# EAGLE design sensor-breakout (EAGLE 6.5.0)
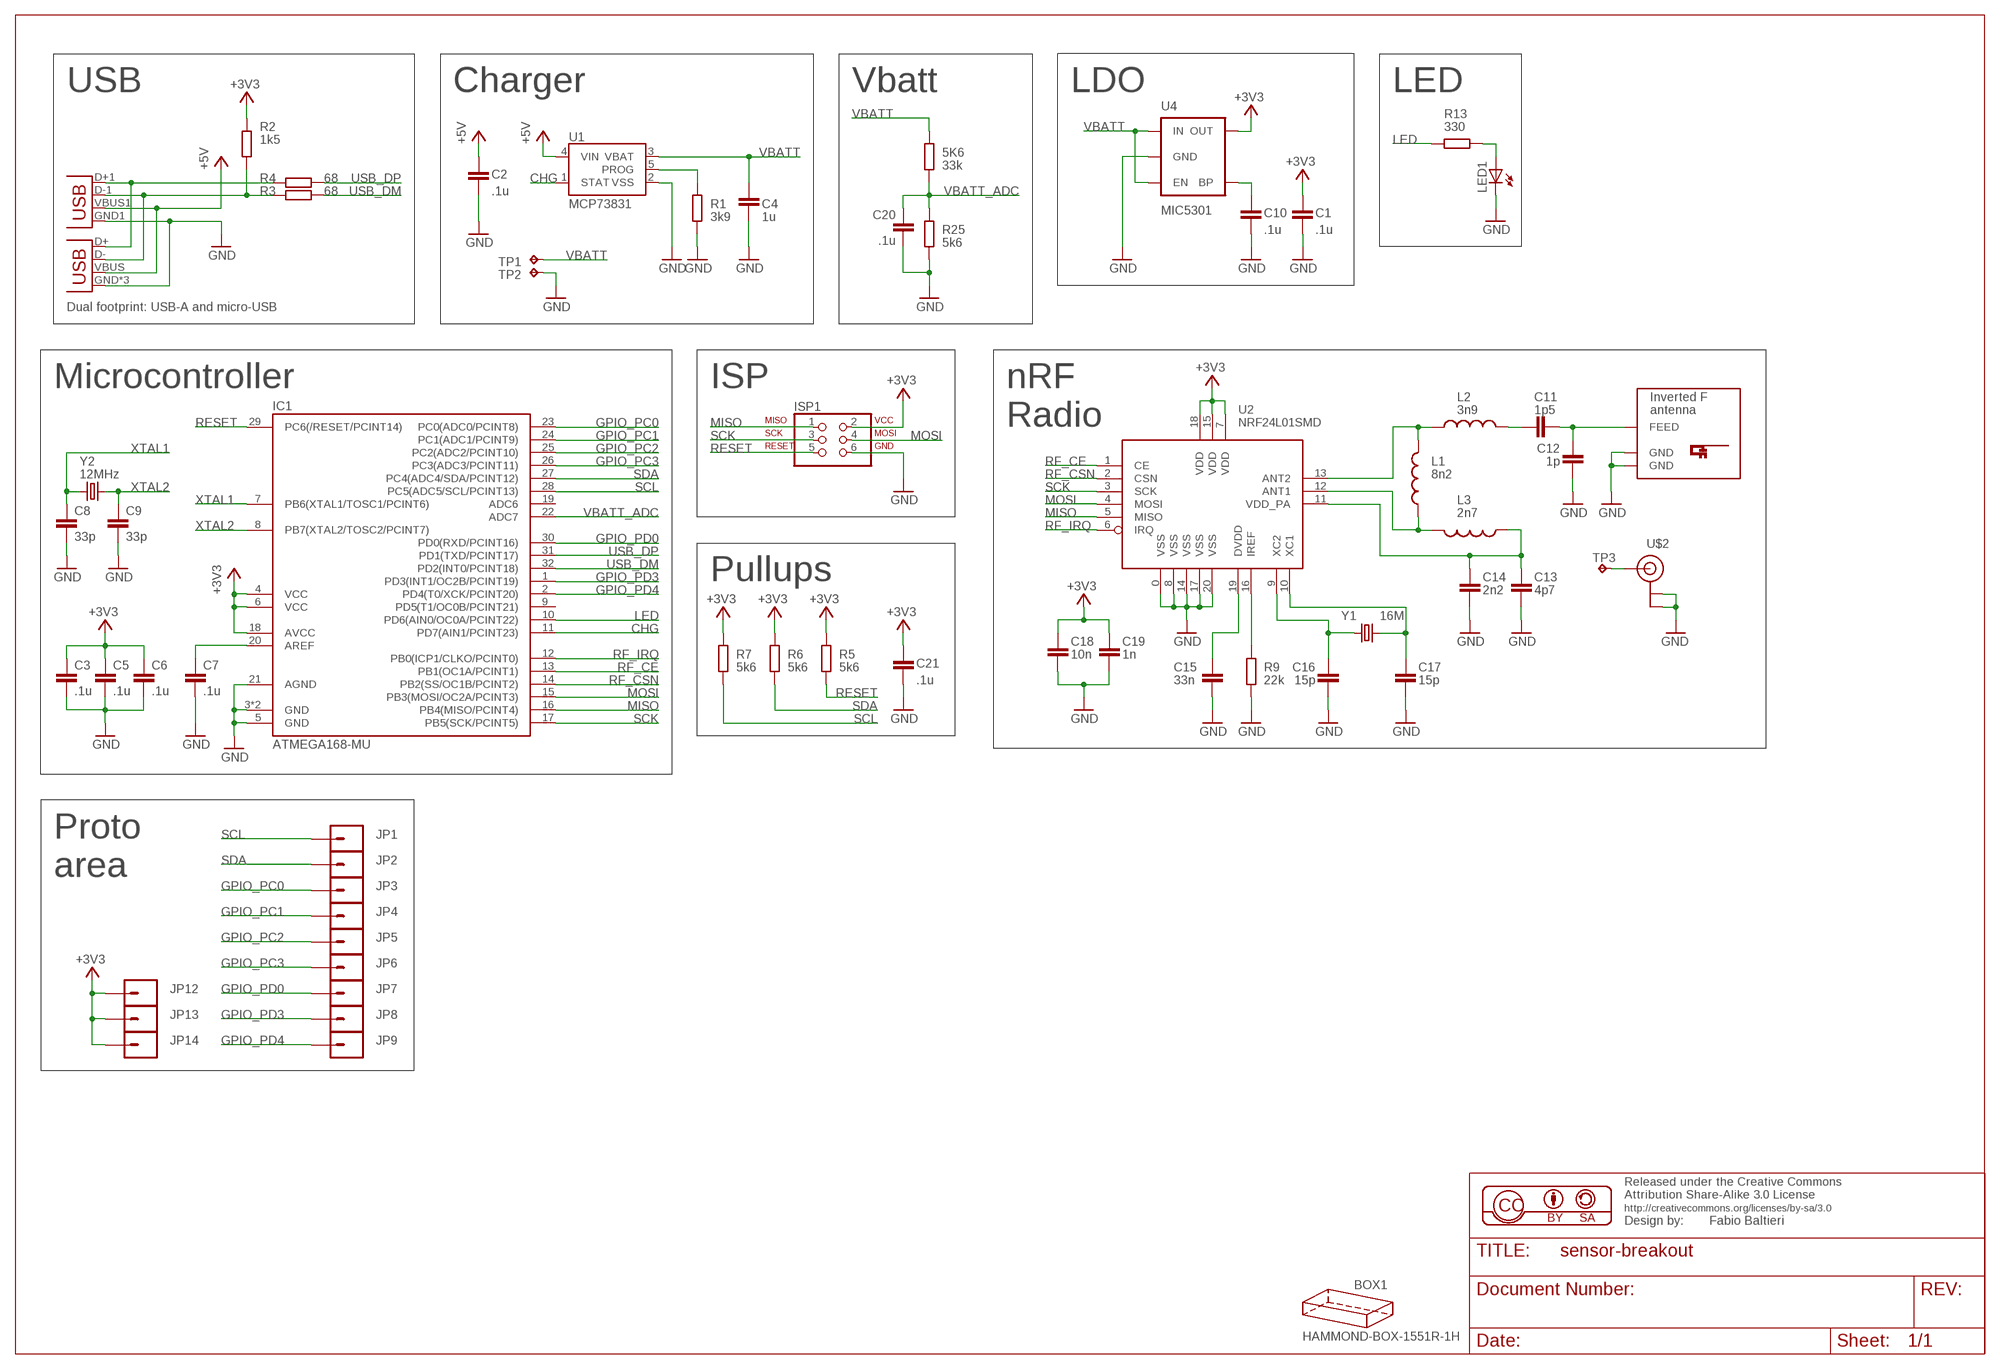
[diagram p0: schematic, sheet 1]

## Parts
5K6  33k  R-EU_R0603  [R0603]
BOX1  HAMMOND-BOX-1551R-1H  [1551R-1HOLE]
C1  .1u  C-EUC0603  [C0603]
C2  .1u  C-EUC0603  [C0603]
C3  .1u  C-EUC0603  [C0603]
C4  1u  C-EUC0603  [C0603]
C5  .1u  C-EUC0603  [C0603]
C6  .1u  C-EUC0603  [C0603]
C7  .1u  C-EUC0603  [C0603]
C8  33p  C-EUC0603  [C0603]
C9  33p  C-EUC0603  [C0603]
C10  .1u  C-EUC0603  [C0603]
C11  1p5  C-EUC0603  [C0603]
C12  1p  C-EUC0603  [C0603]
C13  4p7  C-EUC0603  [C0603]
C14  2n2  C-EUC0603  [C0603]
C15  33n  C-EUC0603  [C0603]
C16  15p  C-EUC0603  [C0603]
C17  15p  C-EUC0603  [C0603]
C18  10n  C-EUC0603  [C0603]
C19  1n  C-EUC0603  [C0603]
C20  .1u  C-EUC0603  [C0603]
C21  .1u  C-EUC0603  [C0603]
IC1  ATMEGA168-MU  [MLF32-TH]
ISP1  ISP-AVR910PTH  [2X03]
JP1  M01NOSILK-KIT  [1X01NS-KIT]
JP2  M01NOSILK-KIT  [1X01NS-KIT]
JP3  M01NOSILK-KIT  [1X01NS-KIT]
JP4  M01NOSILK-KIT  [1X01NS-KIT]
JP5  M01NOSILK-KIT  [1X01NS-KIT]
JP6  M01NOSILK-KIT  [1X01NS-KIT]
JP7  M01NOSILK-KIT  [1X01NS-KIT]
JP8  M01NOSILK-KIT  [1X01NS-KIT]
JP9  M01NOSILK-KIT  [1X01NS-KIT]
JP10  USB-MICROB  [USB-MICROB]
JP11  USBA-SMD-MALE  [USB-A-SMT-MALE]
JP12  M01NOSILK-KIT  [1X01NS-KIT]
JP13  M01NOSILK-KIT  [1X01NS-KIT]
JP14  M01NOSILK-KIT  [1X01NS-KIT]
L1  8n2  INDUCTOR0603  [0603]
L2  3n9  INDUCTOR0603  [0603]
L3  2n7  INDUCTOR0603  [0603]
LED1  LEDSML0805  [SML0805]
R1  3k9  R-EU_R0603  [R0603]
R2  1k5  R-EU_R0603  [R0603]
R3  68  R-EU_R0603  [R0603]
R4  68  R-EU_R0603  [R0603]
R5  5k6  R-EU_R0603  [R0603]
R6  5k6  R-EU_R0603  [R0603]
R7  5k6  R-EU_R0603  [R0603]
R9  22k  R-EU_R0603  [R0603]
R13  330  R-EU_R0603  [R0603]
R25  5k6  R-EU_R0603  [R0603]
TP1  TPTP12R  [TP12R]
TP2  TPTP12R  [TP12R]
TP3  TPTP08SQ  [TP08SQ]
U1  MCP73831  [SOT23-5]
U2  NRF24L01SMD  [QFN20]
U4  MIC5301  V_REG_LDOSMD  [SOT23-5]
U$1  INVERTED_F_ANTENNA-2  [DN007-2]
U$2  U.FL  [U.FL]
Y1  16M  CRYSTAL5X3  [CRYSTAL-SMD-5X3]
Y2  12MHz  CRYSTAL5X3  [CRYSTAL-SMD-5X3]

## Nets
+3V3: C1.1 C3.1 C5.1 C6.1 C18.1 C19.1 C21.1 IC1.4(VCC) IC1.6(VCC) IC1.18(AVCC) ISP1.2 JP12.1 JP13.1 JP14.1 R2.2 R5.1 R6.1 R7.1 U2.7(VDD) U2.15(VDD) U2.18(VDD) U4.5(OUT)
+5V: C2.1 JP10.VBUS JP11.VBUS1(VBUS) U1.4(VIN)
CHG: IC1.11(PD7(AIN1/PCINT23)) U1.1(STAT)
GND: C1.2 C2.2 C3.2 C4.2 C5.2 C6.2 C7.2 C8.2 C9.2 C10.2 C12.2 C13.2 C14.2 C15.2 C16.2 C17.2 C18.2 C19.2 C20.2 C21.2 IC1.3(GND) IC1.5(GND) IC1.21(AGND) IC1.TH(GND) ISP1.6 JP10.GND JP10.MT1(GND) JP10.MT2(GND) JP11.GND1(GND) LED1.C R1.2 R9.2 R25.2 TP2.TP U1.2(VSS) U2.0(VSS) U2.8(VSS) U2.14(VSS) U2.17(VSS) U2.20(VSS) U4.2(GND) U$1.GND U$1.GND@1(GND) U$2.P$1(GND) U$2.P$2(GND)
GPIO_PC0: IC1.23(PC0(ADC0/PCINT8)) JP3.1
GPIO_PC1: IC1.24(PC1(ADC1/PCINT9)) JP4.1
GPIO_PC2: IC1.25(PC2(ADC2/PCINT10)) JP5.1
GPIO_PC3: IC1.26(PC3(ADC3/PCINT11)) JP6.1
GPIO_PD0: IC1.30(PD0(RXD/PCINT16)) JP7.1
GPIO_PD3: IC1.1(PD3(INT1/OC2B/PCINT19)) JP8.1
GPIO_PD4: IC1.2(PD4(T0/XCK/PCINT20)) JP9.1
LED: IC1.10(PD6(AIN0/OC0A/PCINT22)) R13.2
MISO: IC1.16(PB4(MISO/PCINT4)) ISP1.1 U2.5(MISO)
MOSI: IC1.15(PB3(MOSI/OC2A/PCINT3)) ISP1.4 U2.4(MOSI)
N$1: JP10.D+ JP11.D+1(D+) R4.2
N$2: C7.1 IC1.20(AREF)
N$3: LED1.A R13.1
N$4: R1.1 U1.5(PROG)
N$5: L1.2 L3.2 U2.12(ANT1)
N$6: L1.1 L2.1 U2.13(ANT2)
N$7: JP10.D- JP11.D-1(D-) R2.1 R3.2
N$8: C10.1 U4.4(BP)
N$10: C11.1 L2.2
N$13: C11.2 C12.1 U$1.FEED
N$14: C13.1 C14.1 L3.1 U2.11(VDD_PA)
N$15: C15.1 U2.19(DVDD)
N$16: R9.1 U2.16(IREF)
N$17: C17.1 U2.10(XC1) Y1.3
N$18: C16.1 U2.9(XC2) Y1.1
N$19: TP3.TP U$2.P$3(SIGNAL)
RESET: IC1.29(PC6(/RESET/PCINT14)) ISP1.5 R5.2
RF_CE: IC1.13(PB1(OC1A/PCINT1)) U2.1(CE)
RF_CSN: IC1.14(PB2(SS/OC1B/PCINT2)) U2.2(CSN)
RF_IRQ: IC1.12(PB0(ICP1/CLKO/PCINT0)) U2.6(IRQ)
SCK: IC1.17(PB5(SCK/PCINT5)) ISP1.3 U2.3(SCK)
SCL: IC1.28(PC5(ADC5/SCL/PCINT13)) JP1.1 R7.2
SDA: IC1.27(PC4(ADC4/SDA/PCINT12)) JP2.1 R6.2
USB_DM: IC1.32(PD2(INT0/PCINT18)) R3.1
USB_DP: IC1.31(PD1(TXD/PCINT17)) R4.1
VBATT: 5K6.1 C4.1 TP1.TP U1.3(VBAT) U4.1(IN) U4.3(EN)
VBATT_ADC: 5K6.2 C20.1 IC1.22(ADC7) R25.1
XTAL1: C8.1 IC1.7(PB6(XTAL1/TOSC1/PCINT6)) Y2.1
XTAL2: C9.1 IC1.8(PB7(XTAL2/TOSC2/PCINT7)) Y2.3
Unconnected: IC1.9(PD5(T1/OC0B/PCINT21)) IC1.19(ADC6)

## Notes on the sheet
- USB | Charger | Vbatt | LDO | LED
- Dual footprint: USB-A and micro-USB
- Microcontroller | ISP | nRF
- Radio
- Pullups
- Proto
  area

## Library data of the parts
5K6 R1-R7 R9 R13 R25 = rcl:R-EU_: RESISTOR, European symbol
BOX1 = hammond:HAMMOND-BOX: Hammond Project boxes Hammond 1551 Transluscent Blue 50x35x20mm 1551GTBU http://www.hammondmfg.com/pdf/1551G.pdf Hammond 1551 Transluscent Blue 50x50x20mm 1551RTBU http://www.hammondmfg.com/pdf/1551R.pdf Hammond 1551 Transluscent Blue 60x35x20mm 1551HTBU http://www.hammondmfg.com/pdf/1551H.pdf Hammond 1551 Transluscent Blue 80x40x20mm 1551KTBU http://www.hammondmfg.com/pdf/1551K.pdf Hammond 1591 Transluscent Blue 100x51x22m m 1591XXATBU http://www.hammondmfg.com/pdf/1591XXA.pdf
C1-C21 = rcl:C-EU: CAPACITOR, European symbol
IC1 = balto:ATMEGA168
ISP1 = balto:ISP-AVR910: PIN HEADER
JP1-JP9 JP12-JP14 = SparkFun-Connectors:M01: Header 1 Standard 1-pin 0.1" header. Use with straight break away headers (SKU : PRT-00116), right angle break away headers (PRT-00553), swiss pins (PRT-00743), machine pins (PRT-00117), and female headers (PRT-00115).
JP10 = SparkFun-Connectors:USB: USB Connectors USB-B-PTH is fully proven SKU : PRT-00139/CONN-08278 USB-miniB is fully proven SKU : PRT-00587 USB-A-PCB is untested. USB-A-H is throughly reviewed, but untested. Spark Fun Electronics SKU : PRT-00437 USB-B-SMT is throughly reviewed, but untested. Needs silkscreen touching up. USB-A-S has not been used/tested USB-MB-H has not been used/tested USB-MICROB has been used. CONN-09505; PROD_ID: CONN-09505
JP11 = SparkFun-Connectors:USB: USB Connectors USB-B-PTH is fully proven SKU : PRT-00139/CONN-08278 USB-miniB is fully proven SKU : PRT-00587 USB-A-PCB is untested. USB-A-H is throughly reviewed, but untested. Spark Fun Electronics SKU : PRT-00437 USB-B-SMT is throughly reviewed, but untested. Needs silkscreen touching up. USB-A-S has not been used/tested USB-MB-H has not been used/tested USB-MICROB has been used. CONN-09505
L1-L3 = SparkFun:INDUCTOR: Inductors Basic Inductor/Choke - 0603 and 1206. Footprints are not proven and vary greatly between part numbers.
LED1 = led:LED: LED OSRAM: - CHIPLED LG R971, LG N971, LY N971, LG Q971, LY Q971, LO R971, LY R971 LH N974, LH R974 LS Q976, LO Q976, LY Q976 LO Q996 - Hyper CHIPLED LW Q18S LB Q993, LB Q99A, LB R99A - SideLED LS A670, LO A670, LY A670, LG A670, LP A670 LB A673, LV A673, LT A673, LW A673 LH A674 LY A675 LS A676, LA A676, LO A676, LY A676, LW A676 LS A679, LY A679, LG A679 - Hyper Micro SIDELED® LS Y876, LA Y876, LO Y876, LY Y876 LT Y87S - SmartLED LW L88C, LW L88S LB L89C, LB L89S, LG L890 LS L89K, LO L89K, LY L89K LS L896, LA L896, LO L896, LY L896 - TOPLED LS T670, LO T670, LY T670, LG T670, LP T670 LSG T670, LSP T670, LSY T670, LOP T670, LYG T670 LG T671, LOG T671, LSG T671 LB T673, LV T673, LT T673, LW T673 LH T674 LS T676, LA T676, LO T676, LY T676, LB T676, LH T676, LSB T676, LW T676 LB T67C, LV T67C, LT T67C, LS T67K, LO T67K, LY T67K, LW E67C LS E67B, LA E67B, LO E67B, LY E67B, LB E67C, LV E67C, LT E67C LW T67C LS T679, LY T679, LG T679 LS T770, LO T770, LY T770, LG T770, LP T770 LB T773, LV T773, LT T773, LW T773 LH T774 LS E675, LA E675, LY E675, LS T675 LS T776, LA T776, LO T776, LY T776, LB T776 LHGB T686 LT T68C, LB T68C - Hyper Mini TOPLED® LB M676 - Mini TOPLED Santana® LG M470 LS M47K, LO M47K, LY M47K Source: http://www.osram.convergy.de LUXEON: - LUMILED® LXK2-PW12-R00, LXK2-PW12-S00, LXK2-PW14-U00, LXK2-PW14-V00 LXK2-PM12-R00, LXK2-PM12-S00, LXK2-PM14-U00 LXK2-PE12-Q00, LXK2-PE12-R00, LXK2-PE12-S00, LXK2-PE14-T00, LXK2-PE14-U00 LXK2-PB12-K00, LXK2-PB12-L00, LXK2-PB12-M00, LXK2-PB14-N00, LXK2-PB14-P00, LXK2-PB14-Q00 LXK2-PR12-L00, LXK2-PR12-M00, LXK2-PR14-Q00, LXK2-PR14-R00 LXK2-PD12-Q00, LXK2-PD12-R00, LXK2-PD12-S00 LXK2-PH12-R00, LXK2-PH12-S00 LXK2-PL12-P00, LXK2-PL12-Q00, LXK2-PL12-R00 Source: www.luxeon.com KINGBRIGHT: KA-3528ASYC Source: www.kingbright.com
TP1-TP3 = testpad:TP: Test pad
U1 = SparkFun-PowerIC:MCP73831: Miniature single cell, fully integrated Li-Ion, Li-polymer charge management controller http://ww1.microchip.com/downloads/en/DeviceDoc/21984a.pdf IC-09995; PROD_ID: IC-09995
U2 = SparkFun:NRF24L01: 2.4GHz Low Power Transceiver This is the very popular, low cost, very low power RF transceiver from Nordic Semiconductor. Simple SPI interface. SKU: COM-00690
U4 = SparkFun-PowerIC:V_REG_LDO: Voltage Regulator LDO Standard 150mA LDO voltage regulator in SOT-23 layout. Micrel part MIC5205. BP (by-pass) pin is used to lower output noise with 470pF cap.
U$1 = antenna:INVERTED_F_ANTENNA: 2.4GHz Inverted F Antenna Based on TI Design Note DN007
U$2 = SparkFun-Connectors:U.FL: SMD antenna connector- WRL-09144
Y1 = SparkFun:CRYSTAL: Crystals Various standard crystals. Proven footprints. Spark Fun Electronics SKU : COM-00534
Y2 = SparkFun-FreqCtrl:CRYSTAL: Various standard crystals. Proven footprints. Spark Fun Electronics SKU : COM-00534

## Net classes
1 power: width 0.254 mm

## Board
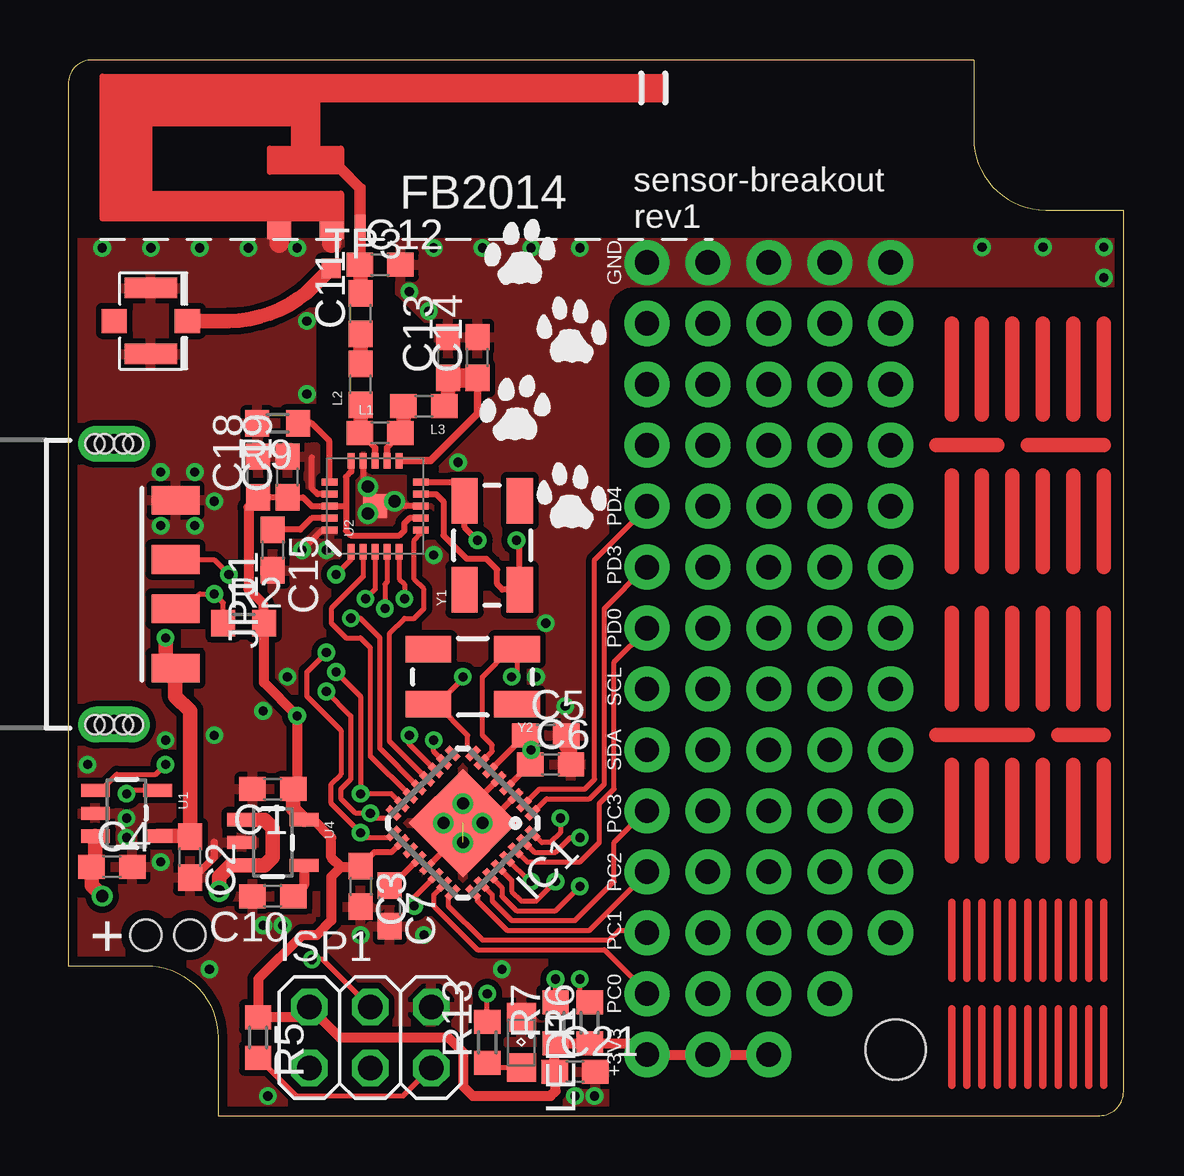
[diagram p1: board, top side]
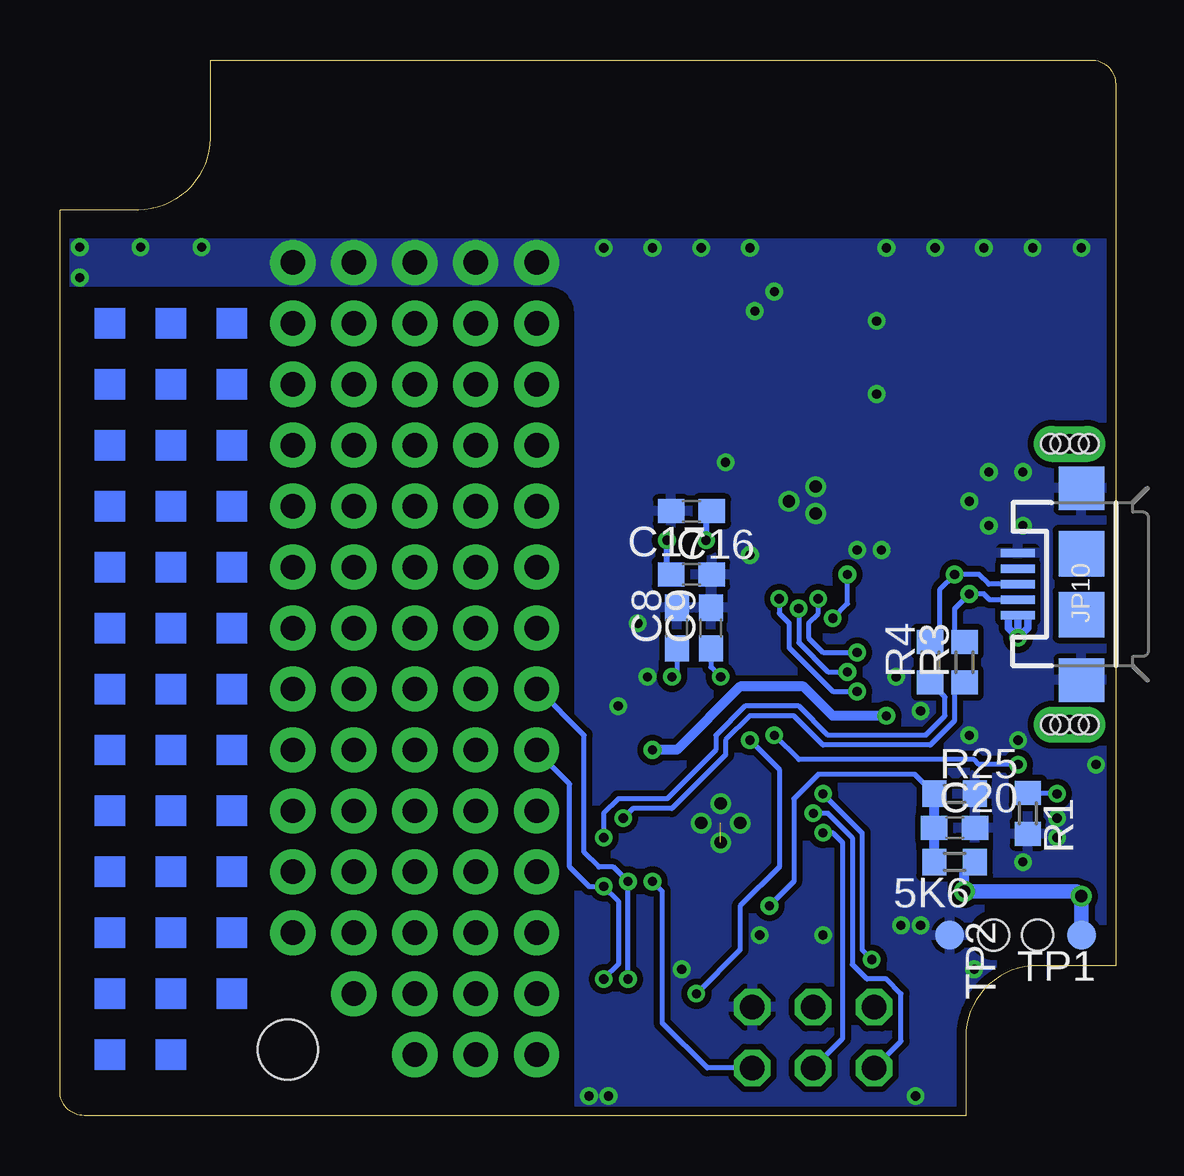
[diagram p2: board, bottom side, seen from below]

Size 44 x 44 mm. Coordinates in mm from the lower left corner, seen from the top.
Copper layers (1*16): Top 0.035mm / dielectric 1.5mm / Bottom 0.035mm
Design rules "balto": minimum track width 6mil, minimum drill 13mil, track to track 6mil, track to pad 6mil, pad to pad 6mil, via to via 6mil, smd to smd 6mil, copper to edge 15mil, drill to drill 6mil, minimum pad ring 7mil, minimum via ring 7mil, stop-mask expansion 2mil, vias tented up to drill 20mil, thermal gap 8mil
Holes 1.3 mm at 5.08,7.52 3.25,7.52

### Footprints (pad centres in the part's own frame; a part is rotated, then mirrored left to right if it is on the bottom)
R0603 = smd 1 x 1.1: 1 -0.85,0; 2 0.85,0
1551R-1HOLE = hole 2.5: 9.5,41.25
C0603 = smd 1.1 x 1: 1 -0.85,0; 2 0.85,0
MLF32-TH = smd 0.65 x 0.29: 1 -2.35,1.75; 2 -2.35,1.25; 3 -2.35,0.75; 4 -2.35,0.25; 5 -2.35,-0.25; 6 -2.35,-0.75; 7 -2.35,-1.25; 8 -2.35,-1.75; 17 2.35,-1.75; 18 2.35,-1.25; 19 2.35,-0.75; 20 2.35,-0.25; 21 2.35,0.25; 22 2.35,0.75; 23 2.35,1.25; 24 2.35,1.75 | smd 0.29 x 0.65: 9 -1.75,-2.35; 10 -1.25,-2.35; 11 -0.75,-2.35; 12 -0.25,-2.35; 13 0.25,-2.35; 14 0.75,-2.35; 15 1.25,-2.35; 16 1.75,-2.35; 25 1.75,2.35; 26 1.25,2.35; 27 0.75,2.35; 28 0.25,2.35; 29 -0.25,2.35; 30 -0.75,2.35; 31 -1.25,2.35; 32 -1.75,2.35 | smd 3.2 x 3.2: TH 0,0
2X03 = drill 1.016 octagon: 1 -2.54,-1.27; 2 -2.54,1.27; 3 0,-1.27; 4 0,1.27; 5 2.54,-1.27; 6 2.54,1.27
1X01NS-KIT = drill 1.016 pad 1.88: 1 0,0
USB-MICROB = smd 0.35 x 1.4: D+ 0,2.65; D- -0.65,2.65; GND 1.3,2.65; ID 0.65,2.65; VBUS -1.3,2.65 | smd 1.8 x 1.9: MT1 -4,0; MT2 4,0 | smd 1.9 x 1.9: P$1 -1.27,0; P$2 1.27,0
USB-A-SMT-MALE = smd 1.2 x 2: D+1 1.027,-3.67; D-1 -1.027,-3.67; GND1 3.5,-3.67; VBUS1 -3.5,-3.67 | drill 0.8 pad 1.5 long: P$1 5.85,-1.1; P$3 -5.85,-1.1 | hole 0.8: -5.85,-1.5; -5.85,-1.9; -5.85,-0.7; -5.85,-0.3; 5.85,-1.5; 5.85,-1.9; 5.85,-0.7; 5.85,-0.3
0603 = smd 1.1 x 1: 1 -0.85,0; 2 0.85,0
SML0805 = smd 1.2 x 1.2: A 1.05,0; C -1.05,0
TP12R = smd 1.2 x 1.2: TP 0,0
TP08SQ = smd 0.8 x 0.8: TP 0,0
SOT23-5 = smd 0.55 x 1.2: 1 -0.95,-1.3; 2 0,-1.3; 3 0.95,-1.3; 4 0.95,1.3; 5 -0.95,1.3
QFN20 = smd 1 x 1: 0 0,0 | smd 0.65 x 0.29: 1 -1.9,1; 2 -1.9,0.5; 3 -1.9,0; 4 -1.9,-0.5; 5 -1.9,-1; 11 1.9,-1; 12 1.9,-0.5; 13 1.9,0; 14 1.9,0.5; 15 1.9,1 | smd 0.29 x 0.65: 6 -1,-1.9; 7 -0.5,-1.9; 8 0,-1.9; 9 0.5,-1.9; 10 1,-1.9; 16 1,1.9; 17 0.5,1.9; 18 0,1.9; 19 -0.5,1.9; 20 -1,1.9
DN007-2 = smd 0.46 x 1: FEED 2.22,-2.8 | smd 1.01 x 0.74: GND -1.16,-2.93; GND@1 1.035,-2.93
U.FL = smd 2.2 x 0.85: P$1 0,1.375; P$2 0,-1.375 | smd 1.05 x 1: P$3 1.525,0; P$4 -1.525,0
CRYSTAL-SMD-5X3 = smd 1.9 x 1.1: 1 -1.85,-1.15; 2 1.85,-1.15; 3 1.85,1.15; 4 -1.85,1.15

### Placement (x,y rotation side)
5K6  6.71,10.57 180 bottom
BOX1  44,44 180 top
C1  8.53,13.61 180 top
C2  5.08,10.77 270 top
C3  12.19,9.55 270 top
C4  1.83,10.36 0 top
C5  19.91,15.85 0 top
C6  20.12,14.63 0 top
C7  13.41,8.74 270 top
C8  18.29,20.32 90 bottom
C9  16.87,20.32 90 bottom
C10  8.53,9.14 180 top
C11  12.19,33.43 90 top
C12  13,35.46 0 top
C13  15.85,31.6 90 top
C14  17.07,31.6 90 top
C15  8.53,23.57 270 top
C16  17.68,22.56 0 bottom
C17  17.68,25.2 180 bottom
C18  7.92,26.62 90 top
C19  9.14,26.62 90 top
C20  6.71,11.99 0 bottom
C21  21.13,1.83 0 top
IC1  16.46,12.19 225 top
ISP1  12.6,3.25 0 top
JP1  24.13,17.78 0 top
JP2  24.13,15.24 0 top
JP3  24.13,5.08 0 top
JP4  24.13,7.62 0 top
JP5  24.13,10.16 0 top
JP6  24.13,12.7 180 top
JP7  24.13,20.32 180 top
JP8  24.13,22.86 180 top
JP9  24.13,25.4 180 top
JP10  1.42,22.15 90 bottom
JP11  0.81,22.15 90 top
JP12  24.13,2.54 0 top
JP13  26.67,2.54 0 top
JP14  29.21,2.54 0 top
L1  13,28.45 0 top
L2  12.19,30.48 90 top
L3  14.83,29.57 180 top
LED1  18.9,3.05 270 top
R1  3.66,12.6 270 bottom
R2  7.32,20.52 0 top
R3  6.3,18.9 90 bottom
R4  7.72,18.9 90 bottom
R5  7.92,3.25 270 top
R6  21.74,3.86 90 top
R7  20.32,3.86 90 top
R9  8.74,28.85 180 top
R13  17.48,3.05 90 top
R25  6.71,13.41 0 bottom
TP1  1.42,7.52 180 bottom
TP2  6.91,7.52 270 bottom
TP3  10.97,35.32 0 top
U1  2.44,12.6 270 top
U2  12.8,25.4 90 top
U4  8.53,11.38 270 top
U$1  9.96,39.83 0 top
U$2  3.45,33.12 0 top
U$3  [CAT-R]  20.93,25.4 0 top
U$4  [CAT-L]  18.69,29.06 0 top
U$5  [CAT-R]  20.93,32.31 0 top
U$6  [CAT-L]  18.9,35.56 0 top
Y1  17.68,23.77 90 top
Y2  16.87,18.29 180 top

### Tracks (layer width: path | path; a pad name or v marks a point on that pad's centre or on a via)
+3V3  (via drill 0.38)
  Top 0.203: C6.1 19.25,14.63
  Top 0.254: U2.15 11.8,26.84 11.58,26.62 11.58,25.4 | 11.58,25.4 11.58,24.38 11.79,24.18 13.82,24.18 14.02,24.38 14.02,24.69 14.23,24.9 U2.7 | 11.58,25.4 U2.18 10.16,25.4 9.79,25.77 C19.1 C18.1 | IC1.6 C5.1 | IC1.4 19.25,14.63 | IC1.18 13.47,10.97 12.76,10.97 C3.1
  Top 0.406: C1.1 9.55,13.78 v9.55,16.66 8.16,18.05 R2.2 8.13,20.56 8.13,21.34 7.52,21.95 7.52,25.36 C18.1 | 11.38,10.36 10.97,9.96 10.97,8.13 10.36,7.52 9.75,7.52 7.92,5.69 R5.1 9.64,4.1 ISP1.2 11.33,3.25 15.85,3.25 16.46,2.64 16.46,1.22 16.87,0.81 20.12,0.81 20.32,1.02 20.32,1.79 C21.1 20.28,2.97 R7.1 R6.1 23.66,3.01 JP12.1 JP13.1 JP14.1 | 11.38,10.36 10.97,10.77 10.97,11.58 10.23,12.33 U4.5 | 11.38,10.36 12.15,10.36 C3.1
  Top 0.61: C5.1 19.3,15.61 v19.3,15.24 19.3,14.67 C6.1 | U4.5 9.38,12.78 C1.1
  Bottom 0.406: v19.3,15.24 18.29,15.24 15.65,17.88 13.01,17.88 11.79,16.66 v9.55,16.66
+5V  (via drill 0.38)
  Top 0.61: U1.4 5.05,11.65 C2.1 5.08,16.87 4.47,17.48 4.47,18.64 JP11.VBUS1 4.06,19.07 v4.06,19.91
  Bottom 0.305: JP10.VBUS v4.06,19.91 | v4.06,19.91 3.66,20.32 3.66,20.73 | v4.06,19.91 4.47,20.32 4.47,20.73
CHG  (via drill 0.38)
  Top 0.203: U1.1 1.36,13.55 2.03,14.22 3.66,14.22 v4.06,14.63 | IC1.11 14.22,15.49 v14.22,15.85
  Bottom 0.203: v4.06,14.63 5.69,14.63 5.89,14.83 13.21,14.83 v14.22,15.85
GND  (via drill 0.38, 0.51, 1.02 pad 1.88)  (1 unrouted)
  Top 0.254: U2.14 12.3,26.42 | U2.8 13.61,25.4 | U2.17 10.42,25.9 10.16,26.16 10.16,27.43 | U2.20 10.58,24.4 9.96,23.77 | IC1.21 16,11.38 v16.46,11.38 | IC1.3 17.52,12.19 v17.27,12.19 17.27,13.36 IC1.5
  Top 0.305: 6.1,11.38 6.1,10.77 5.28,9.96 4.88,9.96
  Top 0.61: C5.2 20.76,15.41 20.93,15.24 20.93,14.67 C6.2
  Top 0.813: U$1.GND 8.8,36.37 | U$1.GND@1 10.99,36.37
  other vias: 17.27,36.17 15.24,36.17 19.3,36.17 21.34,36.17 7.52,36.17 5.49,36.17 3.45,36.17 1.42,36.17 12.5,25.1 12.5,26.21 13.61,25.6 9.55,36.17 16.46,13 15.65,12.19 2.44,12.4 2.44,11.58 3.86,10.57 5.89,6.1 10.77,23.57 9.75,23.57 9.96,30.07 16.26,27.23 9.96,33.12 14.22,34.34 15.04,33.53 21.95,0.81 24.13,35.56 26.67,35.56 29.21,35.56 31.75,35.56 34.29,35.56 21.13,0.81 8.94,7.92 8.13,7.92 8.33,0.81 18.08,6.1 12.19,7.52 14.83,7.52 0.81,14.63 4.06,15.65 3.86,26.82 5.28,26.82 3.86,24.59 5.28,24.59 6.1,25.6 15.24,23.37 19.91,20.52 19.51,18.29 20.73,17.07 9.14,18.29 6.1,15.85 8.13,16.87 38.1,36.2 40.64,36.2 43.18,36.2 43.18,34.92
  pour Top (isolate 0.254): 0,0 22.35,0 22.35,33.48 arc-90 23.62,34.75 44.09,34.75 44.09,36.37 13.82,36.37 13.82,34.34 15.44,32.72 15.44,28.04 10.16,28.04 10.16,35.76 11.38,35.76 11.38,36.37 0,36.37
  pour Bottom (isolate 0.254): 0,0 22.35,0 22.35,33.48 arc-90 23.62,34.75 44.09,34.75 44.09,36.37 0,36.37
  pour Top (isolate 0.254, no thermals): 11.99,24.59 13.41,24.59 13.82,24.99 13.82,26.42 12.19,26.42 11.99,26.21
GPIO_PC0
  Top 0.203: IC1.23 15.24,9.21 15.24,8.74 17.07,6.91 22.35,6.91 24.13,5.13 JP3.1
GPIO_PC1
  Top 0.203: IC1.24 15.85,9.11 15.85,8.74 17.27,7.32 22.55,7.32 22.96,7.72 24.03,7.72 JP4.1
GPIO_PC2
  Top 0.203: IC1.25 17.07,9.11 17.07,8.94 18.29,7.72 21.74,7.72 24.13,10.11 JP5.1
GPIO_PC3
  Top 0.203: IC1.26 17.68,9.21 17.68,8.94 18.49,8.13 21.13,8.13 22.76,9.75 22.76,11.38 24.08,12.7 JP6.1
GPIO_PD0
  Top 0.203: IC1.30 19.14,10.57 21.34,10.57 22.15,11.38 22.15,13.01 22.76,13.61 22.76,18.9 24.13,20.27 JP7.1
GPIO_PD3
  Top 0.203: IC1.1 19.95,13.21 21.74,13.21 22.35,13.82 22.35,21.13 24.08,22.86 JP8.1
GPIO_PD4
  Top 0.203: IC1.2 19.65,13.61 21.54,13.61 21.95,14.02 21.95,23.16 24.13,25.35 JP9.1
LED  (via drill 0.38)
  Top 0.203: IC1.10 15.24,15.18 v15.24,15.65 | R13.2 v17.48,5.08
  Bottom 0.203: v15.24,15.65 14.02,14.43 14.02,10.36 15.65,8.74 15.65,6.91 v17.48,5.08
MISO  (via drill 0.38)
  Top 0.203: U2.5 13.8,22.37 14.02,22.15 v14.02,21.54 | v10.77,17.68 11.79,16.66 11.79,14.02 11.38,13.61 11.38,13.21 11.99,12.6 v12.6,12.6 12.8,12.39 13.34,12.39 IC1.16
  Bottom 0.203: v14.02,21.54 14.02,20.93 13.61,20.52 13.61,19.51 11.79,17.68 v10.77,17.68 | ISP1.1 8.94,3.1 8.94,5.08 9.55,5.69 10.36,5.69 10.97,6.3 10.97,11.58 11.99,12.6 v12.6,12.6
MOSI  (via drill 0.38)
  Top 0.203: U2.4 13.3,22.24 13.21,22.15 v13.21,21.13 | v11.18,18.49 12.19,17.48 v12.19,13.41 13.47,13.41 IC1.15 | ISP1.4 10.62,6.5 v10.16,6.5
  Bottom 0.203: v13.21,21.13 13.21,19.71 11.99,18.49 v11.18,18.49 | v10.16,6.5 10.57,6.91 10.57,11.79 v12.19,13.41
N$1  (via drill 0.38)
  Top 0.203: JP11.D+1 6.08,23.18 v6.71,22.55
  Bottom 0.203: JP10.D+ 5.28,22.15 5.69,22.55 v6.71,22.55 7.32,21.95 7.32,20.15 R4.2
N$2
  Top 0.254: IC1.20 13.5,9.59 C7.1
N$3
  Top 0.203: LED1.A 17.68,2 R13.1
N$4  (via drill 0.38)
  Top 0.203: U1.5 2.58,13.55 v2.44,13.41
  Bottom 0.203: R1.1 2.48,13.45 v2.44,13.41
N$5
  Top 0.279: U2.12 13.3,27.84 13.86,28.39 L1.2
  Top 0.61: L3.2 13.98,28.58 L1.2
N$6
  Top 0.279: U2.13 12.8,27.84 12.19,28.45 L1.1
  Top 0.61: L2.1 12.19,28.48 L1.1
N$7  (via drill 0.38)
  Top 0.203: JP11.D-1 4.87,21.12 5.49,21.74 v6.1,21.74 6.46,21.37 R2.1
  Bottom 0.203: JP10.D- 5.24,21.5 5.49,21.74 v6.1,21.74 6.71,21.13 6.71,20.15 R3.2
N$8
  Top 0.406: U4.4 9.84,9.59 C10.1
N$10
  Top 0.61: C11.1 L2.2
N$12  (via drill 1.02 pad 1.88)
  other vias: 26.67,25.4
N$13
  Top 0.46: U$1.FEED 12.18,35.48 C12.1
  Top 0.61: C11.2 12.19,35.42 C12.1
N$14
  Top 0.305: U2.11 15.11,27.3 17.07,29.26 C14.1
  Top 0.61: C13.1 15.85,29.73 L3.1
  Top 0.813: C14.1 C13.1
N$15
  Top 0.254: U2.19 10.16,24.9 9.68,24.42 C15.1
N$16
  Top 0.254: U2.16 10.9,28.11 10.16,28.85 R9.1
N$17  (via drill 0.38)
  Top 0.254: U2.10 16.27,26.4 16.53,26.14 Y1.3 16.53,24.52 v17.07,23.98
  Bottom 0.254: C17.1 17.07,24.96 v17.07,23.98
N$18  (via drill 0.38)
  Top 0.254: U2.9 15.35,25.9 15.65,25.6 15.65,24.18 16.61,23.22 17.42,23.22 17.88,22.76 17.88,22.15 18.11,21.92 Y1.1 18.83,23.84 v18.69,23.98
  Bottom 0.254: C16.1 18.69,22.72 v18.69,23.98
N$19
  Top 0.61: U$2.P$3 6.7,33.12 arc45 10.23,34.59 TP3.TP
N$20  (via drill 1.02 pad 1.88)
  other vias: 24.13,27.94
N$21  (via drill 1.02 pad 1.88)
  other vias: 26.67,27.94
N$22  (via drill 1.02 pad 1.88)
  other vias: 24.13,30.48
N$23  (via drill 1.02 pad 1.88)
  other vias: 26.67,30.48
N$24  (via drill 1.02 pad 1.88)
  other vias: 24.13,33.02
N$25  (via drill 1.02 pad 1.88)
  other vias: 26.67,33.02
N$27  (via drill 1.02 pad 1.88)
  other vias: 29.21,25.4
N$28  (via drill 1.02 pad 1.88)
  other vias: 29.21,27.94
N$29  (via drill 1.02 pad 1.88)
  other vias: 29.21,30.48
N$30  (via drill 1.02 pad 1.88)
  other vias: 26.67,22.86
N$31  (via drill 1.02 pad 1.88)
  other vias: 29.21,22.86
N$32  (via drill 1.02 pad 1.88)
  other vias: 29.21,20.32
N$33  (via drill 1.02 pad 1.88)
  other vias: 31.75,17.78
N$34  (via drill 1.02 pad 1.88)
  other vias: 29.21,17.78
N$35  (via drill 1.02 pad 1.88)
  other vias: 26.67,17.78
N$36  (via drill 1.02 pad 1.88)
  other vias: 26.67,20.32
N$37  (via drill 1.02 pad 1.88)
  other vias: 26.67,15.24
N$38  (via drill 1.02 pad 1.88)
  other vias: 26.67,12.7
N$39  (via drill 1.02 pad 1.88)
  other vias: 26.67,10.16
N$40  (via drill 1.02 pad 1.88)
  other vias: 26.67,7.62
N$41  (via drill 1.02 pad 1.88)
  other vias: 26.67,5.08
N$44  (via drill 1.02 pad 1.88)
  other vias: 29.21,5.08
N$45  (via drill 1.02 pad 1.88)
  other vias: 29.21,7.62
N$46  (via drill 1.02 pad 1.88)
  other vias: 29.21,10.16
N$47  (via drill 1.02 pad 1.88)
  other vias: 29.21,12.7
N$48  (via drill 1.02 pad 1.88)
  other vias: 29.21,15.24
N$49  (via drill 1.02 pad 1.88)
  other vias: 31.75,15.24
N$50  (via drill 1.02 pad 1.88)
  other vias: 31.75,12.7
N$51  (via drill 1.02 pad 1.88)
  other vias: 31.75,10.16
N$52  (via drill 1.02 pad 1.88)
  other vias: 31.75,7.62
N$53  (via drill 1.02 pad 1.88)
  other vias: 31.75,20.32
N$54  (via drill 1.02 pad 1.88)
  other vias: 31.75,22.86
N$55  (via drill 1.02 pad 1.88)
  other vias: 31.75,25.4
N$56  (via drill 1.02 pad 1.88)
  other vias: 31.75,27.94
N$57  (via drill 1.02 pad 1.88)
  other vias: 31.75,30.48
N$58  (via drill 1.02 pad 1.88)
  other vias: 29.21,33.02
N$59  (via drill 1.02 pad 1.88)
  other vias: 31.75,33.02
N$60  (via drill 1.02 pad 1.88)
  other vias: 34.29,7.62
N$61  (via drill 1.02 pad 1.88)
  other vias: 34.29,10.16
N$62  (via drill 1.02 pad 1.88)
  other vias: 34.29,12.7
N$63  (via drill 1.02 pad 1.88)
  other vias: 34.29,15.24
N$64  (via drill 1.02 pad 1.88)
  other vias: 34.29,17.78
N$65  (via drill 1.02 pad 1.88)
  other vias: 34.29,20.32
N$66  (via drill 1.02 pad 1.88)
  other vias: 34.29,22.86
N$67  (via drill 1.02 pad 1.88)
  other vias: 34.29,25.4
N$68  (via drill 1.02 pad 1.88)
  other vias: 34.29,27.94
N$69  (via drill 1.02 pad 1.88)
  other vias: 34.29,30.48
N$70  (via drill 1.02 pad 1.88)
  other vias: 34.29,33.02
N$71
  Top 0.61: 41.91,33.02 41.91,29.21
N$72
  Top 0.61: 40.64,33.02 40.64,29.21
N$73
  Top 0.61: 39.37,33.02 39.37,29.21
N$74
  Top 0.61: 38.1,33.02 38.1,29.21
N$75
  Top 0.61: 41.91,26.67 41.91,22.86
N$76
  Top 0.61: 40.64,26.67 40.64,22.86
N$77
  Top 0.61: 39.37,22.86 39.37,26.67
N$78
  Top 0.61: 38.1,26.67 38.1,22.86
N$79  (via drill 1.02 pad 1.88)
  other vias: 31.75,5.08
N$80
  Top 0.61: 36.83,22.86 36.83,26.67
N$81
  Top 0.61: 36.83,29.21 36.83,33.02
N$82
  Top 0.61: 36.2,27.94 38.73,27.94
N$83
  Top 0.61: 40.01,27.94 43.18,27.94
N$84
  Top 0.61: 36.83,20.95 36.83,17.14
N$85
  Top 0.61: 38.1,17.14 38.1,20.95
N$86
  Top 0.61: 39.37,20.95 39.37,17.14
N$87
  Top 0.61: 40.64,20.95 40.64,17.14
N$88
  Top 0.61: 41.91,17.14 41.91,20.95
N$89
  Top 0.61: 41.27,15.88 43.18,15.88
N$90
  Top 0.61: 40.01,15.88 36.2,15.88
N$91
  Top 0.61: 36.83,14.61 36.83,10.79
N$92
  Top 0.61: 38.1,10.79 38.1,14.61
N$93
  Top 0.61: 39.37,14.61 39.37,10.79
N$94
  Top 0.61: 40.64,10.79 40.64,14.61
N$95
  Top 0.61: 41.91,14.61 41.91,10.79
N$96
  Top 0.305: 36.83,8.89 36.83,5.71
N$97
  Top 0.305: 37.47,5.71 37.47,8.89
N$98
  Top 0.305: 38.1,8.89 38.1,5.71
N$99
  Top 0.305: 38.73,5.71 38.73,8.89
N$100
  Top 0.305: 39.37,8.89 39.37,5.71
N$101
  Top 0.305: 40.01,5.71 40.01,8.89
N$102
  Top 0.305: 40.64,8.89 40.64,5.71
N$103
  Top 0.305: 41.27,8.89 41.27,5.71
N$104
  Top 0.305: 41.91,8.89 41.91,5.71
N$105
  Top 0.305: 36.83,4.45 36.83,1.27
N$106
  Top 0.305: 37.47,4.45 37.47,1.27
N$107
  Top 0.305: 38.1,4.45 38.1,1.27
N$108
  Top 0.305: 38.73,4.45 38.73,1.27
N$109
  Top 0.305: 39.37,4.45 39.37,1.27
N$110
  Top 0.305: 40.01,4.45 40.01,1.27
N$111
  Top 0.305: 40.64,4.45 40.64,1.27
N$112
  Top 0.305: 41.27,4.45 41.27,1.27
N$113
  Top 0.305: 41.91,4.45 41.91,1.27
N$114
  Top 0.61: 43.18,33.02 43.18,29.21
N$115
  Top 0.61: 43.18,26.67 43.18,22.86
N$116
  Top 0.61: 43.18,20.95 43.18,17.14
N$117
  Top 0.61: 43.18,14.61 43.18,10.79
N$118
  Top 0.305: 42.55,8.89 42.55,5.71
N$119
  Top 0.305: 43.18,5.71 43.18,8.89
N$120
  Top 0.305: 43.18,4.45 43.18,1.27
N$121
  Top 0.305: 42.55,1.27 42.55,4.45
RESET  (via drill 0.38)
  Top 0.203: R5.2 9.51,0.81 13.97,0.81 ISP1.5 | IC1.29 19.25,9.75 v19.3,9.75
  Bottom 0.203: ISP1.5 17.02,1.98 18.9,3.86 18.9,9.35 v19.3,9.75
RF_CE  (via drill 0.38)
  Top 0.203: IC1.13 13.01,15.29 13.01,19.91 12.19,20.73 v11.79,20.73 | U2.1 11.8,23.18 v11.18,22.55
  Bottom 0.203: v11.79,20.73 11.18,21.34 v11.18,22.55
RF_CSN
  Top 0.203: IC1.14 12.6,14.99 12.6,19.51 12.19,19.91 11.58,19.91 10.97,20.52 10.97,21.13 12.3,22.46 U2.2
RF_IRQ
  Top 0.203: IC1.12 13.41,15.59 13.41,20.12 14.02,20.73 14.43,20.73 14.83,21.13 14.83,21.95 14.43,22.35 14.43,23.98 14.7,24.25 U2.6
SCK  (via drill 0.38)
  Top 0.203: U2.3 12.8,21.95 v12.39,21.54 | v10.77,19.3 9.96,18.49 9.96,17.48 11.38,16.05 11.38,14.22 10.97,13.82 10.97,13.01 v12.19,11.79 12.39,11.58 13.41,11.58 13.56,11.73 IC1.17
  Bottom 0.203: v12.39,21.54 12.39,20.93 12.8,20.52 12.8,19.91 12.19,19.3 v10.77,19.3 | ISP1.3 11.38,3.2 11.38,11.38 11.79,11.79 v12.19,11.79
SCL  (via drill 0.38)
  Top 0.203: IC1.28 18.49,9.81 18.49,9.35 18.9,8.94 19.51,8.94 v20.32,9.75 | R7.2 v20.32,5.69
  Bottom 0.203: v20.32,5.69 v20.32,9.75 20.93,10.36 21.54,10.36 22.15,10.97 22.15,15.85 24.08,17.78 JP1.1
SDA  (via drill 0.38)
  Top 0.203: IC1.27 18.09,9.51 18.09,9.14 18.69,8.53 20.32,8.53 v21.34,9.55 | R6.2 21.34,5.12 v21.34,5.69
  Bottom 0.203: v21.34,5.69 20.73,6.3 20.73,8.94 v21.34,9.55 21.95,9.55 22.76,10.36 22.76,13.82 24.13,15.19 JP2.1
USB_DM  (via drill 0.38)
  Top 0.203: IC1.32 19.75,11.38 20.12,11.38 20.52,11.79 v20.52,12.39
  Bottom 0.203: v20.52,12.39 20.12,12.8 18.49,12.8 16.26,15.04 16.26,15.65 15.24,16.66 13.41,16.66 12.19,15.44 7.72,15.44 6.71,16.46 6.71,17.64 R3.1
USB_DP  (via drill 0.38)
  Top 0.203: IC1.31 19.45,10.97 20.32,10.97 20.93,11.58 v21.34,11.58
  Bottom 0.203: v21.34,11.58 21.34,12.6 20.73,13.21 18.69,13.21 16.66,15.24 16.66,15.85 15.44,17.07 13.21,17.07 11.99,15.85 7.92,15.85 7.11,16.66 7.11,17.44 R4.1
VBATT  (via drill 0.51)
  Top 0.61: U1.3 1.14,10.52 C4.1 0.98,9.59 v1.42,9.14 | U4.1 8.19,12.33 8.53,11.99 8.53,10.77 8.19,10.43 U4.3 6.77,10.43 6.3,9.96 v6.3,9.35
  Bottom 0.406: v6.3,9.35 6.3,10.12 5K6.1
  Bottom 0.61: TP1.TP v1.42,9.14 1.63,9.35 v6.3,9.35
VBATT_ADC  (via drill 0.38)
  Top 0.203: IC1.22 14.43,9.1 v14.43,8.74
  Bottom 0.203: R25.1 8.37,14.22 12.39,14.22 13.41,13.21 13.41,9.75 v14.43,8.74
  Bottom 0.406: 5K6.2 C20.1 R25.1
XTAL1  (via drill 0.38)
  Top 0.203: IC1.7 17.68,15.18 17.68,15.44 17.27,15.85 17.27,18.29 18.42,19.44 Y2.1 18.72,18.51 v18.49,18.29
  Bottom 0.203: C8.1 18.29,18.49 v18.49,18.29
XTAL2  (via drill 0.38)
  Top 0.203: IC1.8 16.66,15.31 16.66,15.85 15.37,17.14 | 15.37,17.14 Y2.3 | 15.37,17.14 16.46,18.22 v16.46,18.29
  Bottom 0.203: C9.1 16.87,18.69 v16.46,18.29
(copper drawn outside any net)
  shapes: Bottom area x38

### Text on the board
_tsilk: FB2014 | sensor-breakout / rev1 | GND | PD4 | PD3 | PD0 | SCL | SDA | PC3 | PC2 | + | PC1 | PC0 | +3V3